# EAGLE board GEVCU-4 (EAGLE 6.1)
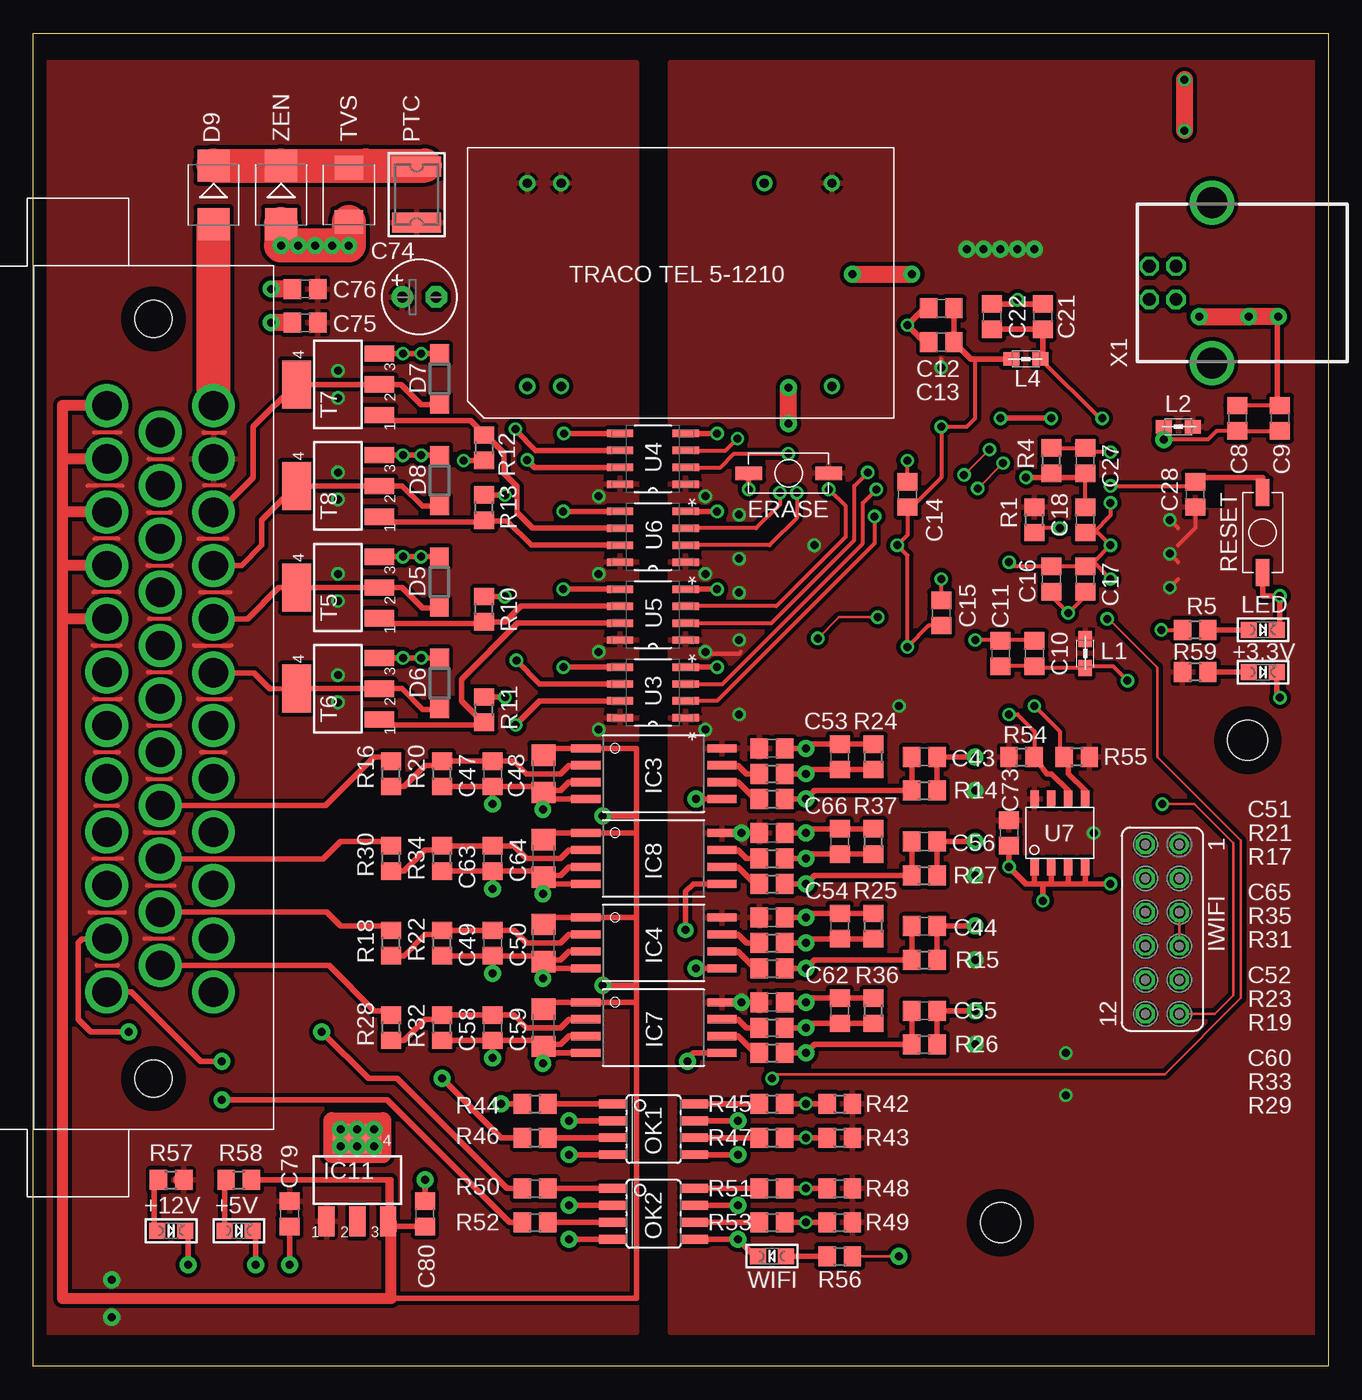
[diagram p2: board, top side]
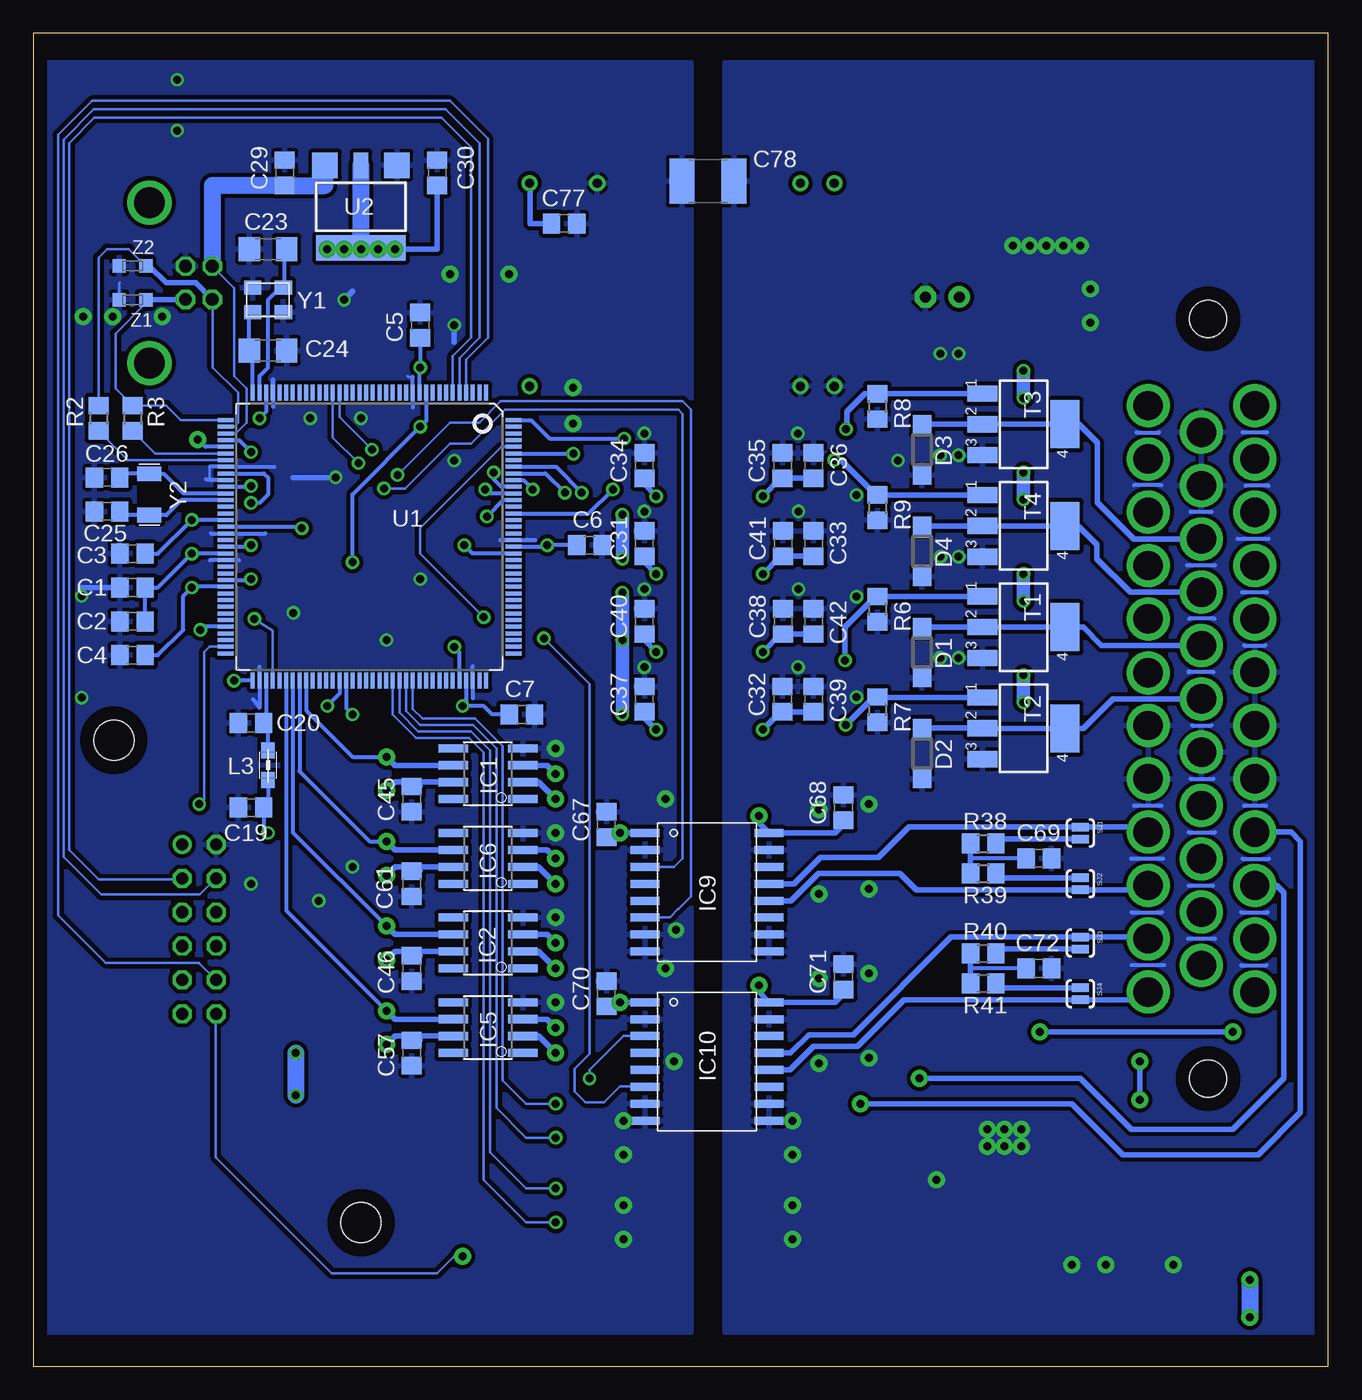
[diagram p3: board, bottom side, seen from below]

Size 97.16 x 100 mm. Coordinates in mm from the lower left corner, seen from the top.
Outline: 0,100 97.16,100 97.16,0 0,0 0,100
Copper layers (1*16): Top 0.035mm / dielectric 1.5mm / Bottom 0.035mm
Design rules: minimum track width 10mil, minimum drill 24mil, track to track 12mil, track to pad 12mil, pad to pad 12mil, via to via 12mil, smd to smd 12mil, copper to edge 40mil, drill to drill 8mil, minimum pad ring 10mil, minimum via ring 8mil, stop-mask expansion 0.1mm, vias tented up to drill 0.6mm, thermal gap 10mil
Net classes: 0 default: width 0.203 mm, drill 0.305 mm, clearance 0.203 mm; 1 USB: drill 0.406 mm, clearance 0.203 mm to class 0, clearance 0.406 mm; 2 gnd: width 0.305 mm, drill 0.406 mm, clearance 0.203 mm to class 0, clearance 0.203 mm; 3 usbvcc: width 0.61 mm, drill 0.508 mm, clearance 0.203 mm to class 0, clearance 0.254 mm
Holes 3 mm at 91.11,46.96 72.57,10.77

## Footprints (pad centres in the part's own frame; a part is rotated, then mirrored left to right if it is on the bottom)
CHIPLED_0805 = smd 1.2 x 1.2: A 0,-1.05; C 0,1.05
AMPSEAL35 = drill 2.2: 1 -20,0; 2 -16,0; 3 -12,0; 4 -8,0; 5 -4,0; 6 0.05,0; 7 4,0; 8 8,0; 9 12,0; 10 16,0; 11 20,0; 12 24,0; 13 -18,-4; 14 -14,-4; 15 -10,-4; 16 -6,-4; 17 -2,-4; 18 2,-4; 19 6,-4; 20 10,-4; 21 14,-4; 22 18,-4; 23 22,-4; 24 -20,-8; 25 -16,-8; 26 -12,-8; 27 -8,-8; 28 -4,-8; 29 0,-8; 30 4,-8; 31 8,-8; 32 12,-8; 33 16,-8; 34 20,-8; 35 24,-8 | hole 2.8: -26.5,-4.5; 30.5,-4.5
C0805 = smd 1.3 x 1.5: 1 -0.95,0; 2 0.95,0
C1206 = smd 1.6 x 1.8: 1 -1.4,0; 2 1.4,0
E2,5-6 = drill 0.813 pad 1.6: + -1.27,0 | drill 0.813 pad 1.6 octagon: - 1.27,0
C1812 = smd 1.9 x 3.4: 1 -1.95,0; 2 1.95,0
SOD123 = smd 1.4 x 1.4: A 1.9,0; C -1.9,0
SMB = smd 2.4 x 2.4: A 2.2,0; C -2.2,0
PUCHBUTTON = smd 2 x 1: P$1 3,0; P$2 -3,0
SO08 = smd 0.61 x 2.21: 1 -1.905,-2.616; 2 -0.635,-2.616; 3 0.635,-2.616; 4 1.905,-2.616; 5 1.905,2.616; 6 0.635,2.616; 7 -0.635,2.616; 8 -1.905,2.616
CK_CUSTOM_SO8-WIDE = smd 0.61 x 2.21: 1 -1.905,-5.069; 2 -0.635,-5.069; 3 0.635,-5.069; 4 1.905,-5.069; 5 1.905,5.136; 6 0.635,5.136; 7 -0.635,5.136; 8 -1.905,5.136
DUB-R-PDSO-G8 = smd 0.6 x 2.2: 1 -4.445,-4.65; 2 -3.175,-4.65; 3 -1.905,-4.65; 4 -0.635,-4.65; 5 0.635,-4.65; 6 1.905,-4.65; 7 3.175,-4.65; 8 4.445,-4.65; 9 -4.445,4.65; 10 -3.175,4.65; 11 -1.905,4.65; 12 -0.635,4.65; 13 0.635,4.65; 14 1.905,4.65; 15 3.175,4.65; 16 4.445,4.65
SOT223 = smd 1.219 x 2.235: 1 -2.311,-3.099; 2 0,-3.099; 3 2.311,-3.099 | smd 3.6 x 2.2: 4 0,3.099
FE06-2 = drill 0.914: 1 -6.35,1.27 | drill 0.914 octagon: 2 -6.35,-1.27; 3 -3.81,1.27; 4 -3.81,-1.27; 5 -1.27,1.27; 6 -1.27,-1.27; 7 1.27,1.27; 8 1.27,-1.27; 9 3.81,1.27; 10 3.81,-1.27; 11 6.35,1.27; 12 6.35,-1.27
0805 = smd 1.2 x 1: 1 -1.1,0; 2 1.1,0
SOIC08 = smd 0.66 x 2.032: 1 -1.905,-3.073; 2 -0.635,-3.073; 3 0.635,-3.073; 4 1.905,-3.073; 5 1.905,3.073; 6 0.635,3.073; 7 -0.635,3.073; 8 -1.905,3.073
PTC1812 = smd 1.5 x 3.7: P$1 -2.1,0; P$2 2.1,0
R0805 = smd 1.3 x 1.5: 1 -0.95,0; 2 0.95,0
SJ_2S-NO = smd 0.635 x 1.27: 1 -0.45,0; 2 0.45,0
SMBJ = smd 1.78 x 2.16: A 2.04,0; C -2.03,0
LQFP144 = smd 0.3 x 1.2: 1 -8.75,-10.8; 2 -8.25,-10.8; 3 -7.75,-10.8; 4 -7.25,-10.8; 5 -6.75,-10.8; 6 -6.25,-10.8; 7 -5.75,-10.8; 8 -5.25,-10.8; 9 -4.75,-10.8; 10 -4.25,-10.8; 11 -3.75,-10.8; 12 -3.25,-10.8; 13 -2.75,-10.8; 14 -2.25,-10.8; 15 -1.75,-10.8; 16 -1.25,-10.8; 17 -0.75,-10.8; 18 -0.25,-10.8; 19 0.25,-10.8; 20 0.75,-10.8; 21 1.25,-10.8; 22 1.75,-10.8; 23 2.25,-10.8; 24 2.75,-10.8; 25 3.25,-10.8; 26 3.75,-10.8; 27 4.25,-10.8; 28 4.75,-10.8; 29 5.25,-10.8; 30 5.75,-10.8; 31 6.25,-10.8; 32 6.75,-10.8; 33 7.25,-10.8; 34 7.75,-10.8; 35 8.25,-10.8; 36 8.75,-10.8; 73 8.75,10.8; 74 8.25,10.8; 75 7.75,10.8; 76 7.25,10.8; 77 6.75,10.8; 78 6.25,10.8; 79 5.75,10.8; 80 5.25,10.8; 81 4.75,10.8; 82 4.25,10.8; 83 3.75,10.8; 84 3.25,10.8; 85 2.75,10.8; 86 2.25,10.8; 87 1.75,10.8; 88 1.25,10.8; 89 0.75,10.8; 90 0.25,10.8; 91 -0.25,10.8; 92 -0.75,10.8; 93 -1.25,10.8; 94 -1.75,10.8; 95 -2.25,10.8; 96 -2.75,10.8; 97 -3.25,10.8; 98 -3.75,10.8; 99 -4.25,10.8; 100 -4.75,10.8; 101 -5.25,10.8; 102 -5.75,10.8; 103 -6.25,10.8; 104 -6.75,10.8; 105 -7.25,10.8; 106 -7.75,10.8; 107 -8.25,10.8; 108 -8.75,10.8 | smd 1.2 x 0.3: 37 10.8,-8.75; 38 10.8,-8.25; 39 10.8,-7.75; 40 10.8,-7.25; 41 10.8,-6.75; 42 10.8,-6.25; 43 10.8,-5.75; 44 10.8,-5.25; 45 10.8,-4.75; 46 10.8,-4.25; 47 10.8,-3.75; 48 10.8,-3.25; 49 10.8,-2.75; 50 10.8,-2.25; 51 10.8,-1.75; 52 10.8,-1.25; 53 10.8,-0.75; 54 10.8,-0.25; 55 10.8,0.25; 56 10.8,0.75; 57 10.8,1.25; 58 10.8,1.75; 59 10.8,2.25; 60 10.8,2.75; 61 10.8,3.25; 62 10.8,3.75; 63 10.8,4.25; 64 10.8,4.75; 65 10.8,5.25; 66 10.8,5.75; 67 10.8,6.25; 68 10.8,6.75; 69 10.8,7.25; 70 10.8,7.75; 71 10.8,8.25; 72 10.8,8.75; 109 -10.8,8.75; 110 -10.8,8.25; 111 -10.8,7.75; 112 -10.8,7.25; 113 -10.8,6.75; 114 -10.8,6.25; 115 -10.8,5.75; 116 -10.8,5.25; 117 -10.8,4.75; 118 -10.8,4.25; 119 -10.8,3.75; 120 -10.8,3.25; 121 -10.8,2.75; 122 -10.8,2.25; 123 -10.8,1.75; 124 -10.8,1.25; 125 -10.8,0.75; 126 -10.8,0.25; 127 -10.8,-0.25; 128 -10.8,-0.75; 129 -10.8,-1.25; 130 -10.8,-1.75; 131 -10.8,-2.25; 132 -10.8,-2.75; 133 -10.8,-3.25; 134 -10.8,-3.75; 135 -10.8,-4.25; 136 -10.8,-4.75; 137 -10.8,-5.25; 138 -10.8,-5.75; 139 -10.8,-6.25; 140 -10.8,-6.75; 141 -10.8,-7.25; 142 -10.8,-7.75; 143 -10.8,-8.25; 144 -10.8,-8.75
SOT223-W = smd 1.9 x 1.9: 1 -2.7,-3.1; 3 2.7,-3.1 | smd 1.1 x 1.9: 2 0,-3.1 | smd 6.7 x 1.9: 4 0,3.1
SOIC127P600X175-8N = smd 1.981 x 0.559: 1 -2.464,1.905; 2 -2.464,0.635; 3 -2.464,-0.635; 4 -2.464,-1.905; 5 2.464,-1.905; 6 2.464,-0.635; 7 2.464,0.635; 8 2.464,1.905
CK_CUSTOM_SOIC8 = smd 0.635 x 1.27: PIN1 -1.905,-2.54; PIN2 -0.635,-2.54; PIN3 0.635,-2.54; PIN4 1.905,-2.54; PIN5 1.905,2.54; PIN6 0.635,2.54; PIN7 -0.635,2.54; PIN8 -1.905,2.54
TRACO = drill 0.7: +VIN1 4.5,17.64; +VIN2 7.04,17.64; +VOUT 27.36,17.64; -VIN1 4.5,2.4; -VIN2 7.04,2.4; -VOUT 22.28,17.64; P$6 27.36,2.4
PN61729-S = drill 0.95 octagon: 1 1.25,4.71; 2 -1.25,4.71; 3 -1.25,2.71; 4 1.25,2.71 | drill 2.3 pad 2.9: S1 -6.02,0; S2 6.02,0
CRYSTAL-3.2-2.5 = smd 1.3 x 1.05: 1 -1.15,-0.925; 2 1.15,-0.925; 3 1.15,0.925; 4 -1.15,0.925
RESONATOR_EPSON_FC_145 = smd 1.1 x 1.8: P$1 -1.55,0; P$2 1.55,0
CT/CN0603 = smd 1 x 1: 1 -1,0; 2 1,0

## Placement (x,y rotation side)
+3.3V  [CHIPLED_0805]  92.25,52.07 270 top
+5V  [CHIPLED_0805]  15.42,10.16 270 top
+12V  [CHIPLED_0805]  10.34,10.16 270 top
AMPSEAL1  776163-1  [AMPSEAL35]  13.51,52.07 270 top
C1  10u  [C0805]  89.71,58.42 180 bottom
C2  0.1u  [C0805]  89.71,55.88 180 bottom
C3  0.1u  [C0805]  89.71,60.96 180 bottom
C4  0.1u  [C0805]  89.71,53.34 180 bottom
C5  0.1u  [C0805]  68.12,78.11 90 bottom
C6  0.1u  [C0805]  55.42,61.59 0 bottom
C7  0.1u  [C0805]  60.5,48.9 0 bottom
C8  0.1u  [C0805]  90.35,71.12 90 top
C9  10u  [C0805]  93.52,71.12 90 top
C10  0.1u  [C0805]  75.11,53.47 90 top
C11  10u  [C0805]  72.57,53.47 90 top
C12  10u  [C0805]  68.12,79.38 180 top
C13  0.1u  [C0805]  68.12,76.83 180 top
C14  0.1u  [C0805]  65.58,65.41 90 top
C15  0.1u  [C0805]  68.12,56.52 90 top
C16  0.1u  [C0805]  76.38,59.05 270 top
C17  0.1u  [C0805]  78.92,59.05 270 top
C18  0.1u  [C0805]  78.92,63.5 90 top
C19  0.1u  [C0805]  80.82,41.91 180 bottom
C20  0.1u  [C0805]  80.82,48.26 180 bottom
C21  0.1u  [C0805]  75.74,78.74 90 top
C22  10u  [C0805]  71.93,78.74 90 top
C23  22p  [C1206]  79.55,83.82 180 bottom
C24  22p  [C1206]  79.55,76.2 0 bottom
C25  22p  [C0805]  91.62,64.14 180 bottom
C26  22p  [C0805]  91.62,66.67 180 bottom
C27  22p  [C0805]  78.92,67.94 270 top
C28  0.01u  [C0805]  87.17,65.41 90 top
C29  10u  [C0805]  78.28,89.53 90 bottom
C30  10u  [C0805]  66.85,89.53 90 bottom
C31  0.1u  [C0805]  51.31,61.72 90 bottom
C32  0.1u  [C0805]  40.94,50.04 90 bottom
C33  10u  [C0805]  38.61,61.72 90 bottom
C34  0.1u  [C0805]  51.31,67.56 90 bottom
C35  0.1u  [C0805]  40.94,67.56 90 bottom
C36  10u  [C0805]  38.61,67.56 90 bottom
C37  0.1u  [C0805]  51.31,50.04 90 bottom
C38  0.1u  [C0805]  40.89,55.88 90 bottom
C39  10u  [C0805]  38.61,50.04 90 bottom
C40  0.1u  [C0805]  51.31,55.88 90 bottom
C41  0.1u  [C0805]  40.89,61.72 90 bottom
C42  10u  [C0805]  38.61,55.88 90 bottom
C43  100p  [C0805]  66.85,45.72 180 top
C44  100p  [C0805]  66.85,33.02 180 top
C45  0.1u  [C0805]  68.76,42.55 270 bottom
C46  0.1u  [C0805]  68.76,29.84 270 bottom
C47  0.1u  [C0805]  34.47,44.45 270 top
C48  0.1u  [C1206]  38.28,44.45 270 top
C49  0.1u  [C0805]  34.47,31.75 270 top
C50  0.1u  [C1206]  38.28,31.75 270 top
C51  0.1u  [C0805]  55.42,46.35 0 top
C52  0.1u  [C0805]  55.42,33.66 0 top
C53  100p  [C0805]  60.5,45.72 90 top
C54  100p  [C0805]  60.5,33.02 90 top
C55  100p  [C0805]  66.85,26.67 180 top
C56  100p  [C0805]  66.85,39.37 180 top
C57  0.1u  [C0805]  68.76,23.5 270 bottom
C58  0.1u  [C0805]  34.47,25.4 270 top
C59  0.1u  [C1206]  38.28,25.4 270 top
C60  0.1u  [C0805]  55.42,27.3 0 top
C61  0.1u  [C0805]  68.76,36.2 270 bottom
C62  100p  [C0805]  60.5,26.67 90 top
C63  0.1u  [C0805]  34.47,38.1 270 top
C64  0.1u  [C1206]  38.28,38.1 270 top
C65  0.1u  [C0805]  55.42,40.01 0 top
C66  100p  [C0805]  60.5,39.37 90 top
C67  0.1u  [C0805]  54.15,40.64 90 bottom
C68  0.1u  [C0805]  36.37,41.91 90 bottom
C69  47n  [C0805]  21.72,38.1 0 bottom
C70  0.1u  [C0805]  54.15,27.94 90 bottom
C71  0.1u  [C0805]  36.37,29.21 90 bottom
C72  47n  [C0805]  21.72,29.84 0 bottom
C73  0.1u  [C0805]  73.2,40.01 270 top
C74  100u  [E2,5-6]  28.96,80.21 0 top
C75  1u  [C0805]  20.4,78.28 180 top
C76  0.1u  [C0805]  20.4,80.82 180 top
C77  2u  [C0805]  57.33,85.72 0 bottom
C78  0.01u  [C1812]  46.53,88.9 180 bottom
C79  0.22u  [C0805]  19.23,11.43 270 top
C80  0.1u  [C0805]  29.39,11.43 90 top
D1  MBR0520LT  [SOD123]  30.48,53.54 270 bottom
D2  MBR0520LT  [SOD123]  30.48,45.97 270 bottom
D3  MBR0520LT  [SOD123]  30.48,68.76 270 bottom
D4  MBR0520LT  [SOD123]  30.48,61.14 270 bottom
D5  MBR0520LT  [SOD123]  30.45,58.83 90 top
D6  MBR0520LT  [SOD123]  30.48,51.23 90 top
D7  MBR0520LT  [SOD123]  30.48,74.07 90 top
D8  MBR0520LT  [SOD123]  30.48,66.45 90 top
D9  B360B-13-F  [SMB]  13.51,87.88 270 top
ERASE  PUCHBUTTON  [PUCHBUTTON]  56.67,66.99 180 top
IC1  INA132  [SO08]  63.04,44.45 90 bottom
IC2  INA132  [SO08]  63.04,31.75 90 bottom
IC3  CK_CUSTOM_ACPL-C87A-000E  [CK_CUSTOM_SO8-WIDE]  46.53,44.45 270 top
IC4  CK_CUSTOM_ACPL-C87A-000E  [CK_CUSTOM_SO8-WIDE]  46.53,31.75 270 top
IC5  INA132  [SO08]  63.04,25.4 90 bottom
IC6  INA132  [SO08]  63.04,38.1 90 bottom
IC7  CK_CUSTOM_ACPL-C87A-000E  [CK_CUSTOM_SO8-WIDE]  46.53,25.4 270 top
IC8  CK_CUSTOM_ACPL-C87A-000E  [CK_CUSTOM_SO8-WIDE]  46.53,38.1 270 top
IC9  ISO1050DW  [DUB-R-PDSO-G8]  46.61,35.56 270 bottom
IC10  ISO1050DW  [DUB-R-PDSO-G8]  46.61,22.86 270 bottom
IC11  LM340MP-05  [SOT223]  24.31,13.97 0 top
IWIFI  [FE06-2]  84.71,32.79 270 top
L1  MH2029-300Y  [0805]  78.92,53.47 270 top
L2  MH2029-300Y  [0805]  85.9,70.48 180 top
L3  MH2029-300Y  [0805]  79.55,45.09 90 bottom
L4  MH2029-300Y  [0805]  74.47,75.56 0 top
LED  [CHIPLED_0805]  92.25,55.24 270 top
OK1  ILD213  [SOIC08]  46.53,17.78 270 top
OK2  ILD213  [SOIC08]  46.53,11.43 270 top
PTC  [PTC1812]  28.75,87.88 90 top
R1  100k  [R0805]  75.11,63.5 90 top
R2  39R 1%  [R0805]  92.25,71.12 270 bottom
R3  39R 1%  [R0805]  89.71,71.12 270 bottom
R4  6k8 1%  [R0805]  76.38,67.94 90 top
R5  402R  [R0805]  87.17,55.24 180 top
R6  10k  [R0805]  33.83,56.79 270 bottom
R7  10k  [R0805]  33.83,49.25 270 bottom
R8  10k  [R0805]  33.83,72.01 270 bottom
R9  10k  [R0805]  33.83,64.41 270 bottom
R10  10k  [R0805]  33.83,56.79 90 top
R11  10k  [R0805]  33.83,49.25 90 top
R12  10k  [R0805]  33.83,68.91 270 top
R13  10k  [R0805]  33.83,64.41 90 top
R14  16k 1%  [R0805]  66.85,43.18 0 top
R15  16k 1%  [R0805]  66.85,30.48 0 top
R16  16k  [R0805]  26.85,44.45 90 top
R17  10k 1%  [R0805]  55.42,42.55 0 top
R18  16k  [R0805]  26.85,31.75 90 top
R19  10k 1%  [R0805]  55.42,29.84 0 top
R20  10k  [R0805]  30.66,44.45 90 top
R21  10k 1%  [R0805]  55.42,44.45 0 top
R22  10k  [R0805]  30.66,31.75 90 top
R23  10k 1%  [R0805]  55.42,31.75 0 top
R24  16k 1%  [R0805]  63.04,45.72 90 top
R25  16k 1%  [R0805]  63.04,33.02 90 top
R26  16k 1%  [R0805]  66.85,24.13 0 top
R27  16k 1%  [R0805]  66.85,36.83 0 top
R28  16k  [R0805]  26.85,25.4 90 top
R29  10k 1%  [R0805]  55.42,23.5 0 top
R30  16k  [R0805]  26.85,38.1 90 top
R31  10k 1%  [R0805]  55.42,36.2 0 top
R32  10k  [R0805]  30.66,25.4 90 top
R33  10k 1%  [R0805]  55.42,25.4 0 top
R34  10k  [R0805]  30.66,38.1 90 top
R35  10k 1%  [R0805]  55.42,38.1 0 top
R36  16k 1%  [R0805]  63.04,26.67 90 top
R37  16k 1%  [R0805]  63.04,39.37 90 top
R38  60R  [R0805]  25.88,39.22 0 bottom
R39  60R  [R0805]  25.88,36.98 0 bottom
R40  60R  [R0805]  25.88,30.96 0 bottom
R41  60R  [R0805]  25.88,28.73 0 bottom
R42  10k  [R0805]  60.5,19.68 0 top
R43  10k  [R0805]  60.5,17.14 0 top
R44  1k  [R0805]  37.64,19.68 0 top
R45  1k  [R0805]  55.42,19.68 0 top
R46  1k  [R0805]  37.64,17.14 0 top
R47  1k  [R0805]  55.42,17.14 0 top
R48  10k  [R0805]  60.5,13.34 0 top
R49  10k  [R0805]  60.5,10.79 0 top
R50  1k  [R0805]  37.64,13.34 0 top
R51  1k  [R0805]  55.42,13.34 0 top
R52  1k  [R0805]  37.64,10.79 0 top
R53  1k  [R0805]  55.42,10.79 0 top
R54  4.7k  [R0805]  74.14,45.72 0 top
R55  4.7k  [R0805]  78.28,45.72 180 top
R56  402R  [R0805]  60.5,8.26 0 top
R57  3k3  [R0805]  10.34,13.97 0 top
R58  1k  [R0805]  15.42,13.97 0 top
R59  402R  [R0805]  87.17,52.07 180 top
RESET  PUCHBUTTON  [PUCHBUTTON]  92.23,62.55 270 top
SJ1  SOLDERJUMPERNO  [SJ_2S-NO]  18.59,40.01 270 bottom
SJ2  SOLDERJUMPERNO  [SJ_2S-NO]  18.59,36.2 90 bottom
SJ3  SOLDERJUMPERNO  [SJ_2S-NO]  18.59,31.75 270 bottom
SJ4  SOLDERJUMPERNO  [SJ_2S-NO]  18.59,27.94 90 bottom
T1  [SOT223]  22.86,55.45 270 bottom
T2  [SOT223]  22.86,47.85 270 bottom
T3  [SOT223]  22.86,70.66 270 bottom
T4  [SOT223]  22.86,63.04 270 bottom
T5  [SOT223]  22.86,58.42 90 top
T6  [SOT223]  22.86,50.83 90 top
T7  [SOT223]  22.86,73.66 90 top
T8  [SOT223]  22.86,66.04 90 top
TVS  SMBJ15A-TR  [SMBJ]  23.67,87.88 270 top
U1  ATSAM3X8EA-AU  [LQFP144]  71.93,62.23 180 bottom
U2  [SOT223-W]  72.57,87 180 bottom
U3  ADUM3221BRZ  [SOIC127P600X175-8N]  46.48,50.55 180 top
U4  ADUM3221BRZ  [SOIC127P600X175-8N]  46.48,68.07 180 top
U5  ADUM3221BRZ  [SOIC127P600X175-8N]  46.48,56.39 180 top
U6  ADUM3221BRZ  [SOIC127P600X175-8N]  46.48,62.23 180 top
U7  CK_CUSTOM_M24M02-DRMN6TP  [CK_CUSTOM_SOIC8]  77.01,40.01 0 top
U8  TRACO  [TRACO]  32.56,71.12 0 top
WIFI  [CHIPLED_0805]  55.42,8.26 90 top
X1  PN61729-S  [PN61729-S]  88.44,81.28 90 top
Y1  12MHz KX-7 20pF  [CRYSTAL-3.2-2.5]  79.55,80.01 0 bottom
Y2  32.768Khz  [RESONATOR_EPSON_FC_145]  88.44,65.41 90 bottom
Z1  CG0603MLC-05E  [CT/CN0603]  89.71,80.01 180 bottom
Z2  CG0603MLC-05E  [CT/CN0603]  89.71,82.55 180 bottom
ZEN  1SMB5929BT3G  [SMB]  18.59,87.88 270 top

## Tracks (layer width: path | path; a pad name or v marks a point on that pad's centre or on a via)
+3V3  (via drill 0.6, 0.6 pad 1.27)
  Top 0.305: v68.12,74.93 68.12,75.56 | v85.27,58.42 85.9,59.05 | v85.27,60.96 85.9,60.33 | v85.27,63.5 85.9,62.87 | C28.1 87.17,62.87 85.9,61.59 | 53.09,64.01 v52.96,63.88 | 50.42,53.47 52.96,53.47 53.09,53.59
  Top 0.406: v50.42,65.28 50.42,65.15 | v50.42,53.59 50.42,53.47 | v50.42,47.75 50.42,47.5
  Bottom 0.305: U1.11 68.18,74.87 v68.12,74.93 C5.1 | U1.125 58.71,61.48 v58.6,61.59 C6.1 | U1.105 64.68,49.8 v64.95,49.53 63.36,49.53 62.73,48.9 C7.1 61.14,48.9 | U1.62 85.21,58.48 v85.27,58.42 85.9,57.78 85.9,55.24 87.81,53.34 C4.1 88.44,53.34 | U1.57 85.25,60.98 v85.27,60.96 87.81,58.42 C1.1 C2.1 | U1.52 85.25,63.48 v85.27,63.5 87.81,60.96 C3.1 | L3.1 79.55,42.23 C19.1 79.87,40.33 v79.55,40.01
  Bottom 0.406: 54.15,26.67 C70.1 54.15,27.3 v53.14,27.3 IC10.1 | 53.83,39.37 C67.1 54.15,40.01 v53.14,40.01 IC9.1 | U8.+VOUT 59.87,88.76 59.87,85.72 C77.1 57.96,85.72 | IC1.7 68.12,43.81 | v70.66,43.18 70.03,43.81 68.12,43.81 | IC6.7 68.12,37.47 | v70.66,36.83 70.03,37.47 68.12,37.47 | IC2.7 68.12,31.11 | v70.66,30.48 70.03,31.11 68.12,31.11 | IC5.7 68.12,24.77 | v70.66,24.13 70.03,24.77 68.12,24.77 | C45.1 68.12,43.49 68.12,43.81 | C61.1 68.12,37.15 68.12,37.47 | C46.1 68.12,30.8 68.12,31.11 | C57.1 68.12,24.45 68.12,24.77 | C30.1 66.85,83.82 v71.3,83.82 | 51.31,66.62 C34.1 51.31,66.17 v50.42,65.28 | C31.1 51.31,60.33 v50.42,59.44 | C40.1 51.31,54.48 v50.42,53.59 | C37.1 51.31,48.64 v50.42,47.75
  Bottom 1.016: v52.96,63.88 v52.96,60.58 | v52.96,58.04 v52.96,54.48 v52.96,48.9
  Bottom 1.27: v72.57,83.82 U2.2 | v77.47,23.5 v77.47,20.32
  other vias: 75.11,83.82 73.84,83.82 70.03,83.82
  pour Top: 47.8,97.79 97.16,97.79 97.16,2.54 47.8,2.54
+5V  (via drill 0.6 pad 1.27)
  Top 0.406: C80.1 26.62,10.48 IC11.3 26.62,13.97 | R58.2 26.62,13.97 | 26.62,13.97 26.85,13.97 26.85,10.16 | 26.85,5.08 45.26,5.08 45.26,27.3 | 45.26,27.3 45.26,28.57 | 45.26,28.57 45.26,33.66 | 45.26,33.66 45.26,40.01 | 45.26,41.27 45.26,46.35 IC3.1 38.78,46.35 C48.1 | 45.26,40.01 IC8.1 38.28,40.01 C64.1 | 45.26,33.66 IC4.1 38.78,33.66 C50.1 | 45.26,27.3 IC7.1 38.28,27.3 C59.1 38.28,26.67 | v42.72,41.27 45.26,41.27 | 45.26,41.27 45.26,40.01 | v42.72,28.57 45.26,28.57
  Top 0.813: AMPSEAL1.24 2.18,72.07 2.18,68.07 | 2.18,68.07 2.18,64.07 | 2.18,64.07 2.18,60.07 | 2.18,60.07 2.18,56.07 | AMPSEAL1.25 2.18,68.07 | AMPSEAL1.26 2.18,64.07 | AMPSEAL1.27 2.18,60.07 | AMPSEAL1.28 2.18,56.07 | 2.18,56.07 2.18,5.08 26.85,5.08 26.85,10.16 26.85,10.79
  Bottom 0.406: C71.1 36.37,27.94 37.01,27.3 41.91,27.3 41.96,27.36 IC10.9 42.72,28.07 v42.72,28.57 | C68.1 36.37,40.64 37.01,40.01 IC9.9 | IC9.9 42.72,40.77 v42.72,41.27 | IC9.9
+12V  (via drill 0.6, 0.6 pad 1.27)
  Top 0.305: 6.66,38.08 4.5,38.08 | 12.06,54.07 14.86,54.07 | 12.34,50.06 14.81,50.06 | 4.22,34.06 6.88,34.06 | 4.65,42.06 6.35,42.06 | 12.75,70.05 14.38,70.05 | 8.64,68.07 10.44,68.07 | 12.8,66.09 14.35,66.09 | 8.61,64.06 10.34,64.06 | 12.39,62.08 14.58,62.08 | 12.5,58.06 14.78,58.06 | 12.57,46.08 14.43,46.08 | 4.45,54.08 6.53,54.08 | 4.55,50.06 6.58,50.06 | 4.62,46.08 6.43,46.08 | 8.56,60.07 10.41,60.07 | 8.69,56.08 10.21,56.08 | 8.59,52.07 10.31,52.07 | 8.61,48.08 10.29,48.08 | 8.56,44.07 10.31,44.07 | 4.55,70.08 6.53,70.08 | 4.72,30.07 6.35,30.07 | 8.33,32.08 10.49,32.08 | 8.51,36.07 10.59,36.07 | 8.38,40.06 10.57,40.06 | 6.71,66.06 4.06,66.06 | 6.45,58.06 4.5,58.06 | 6.4,62.08 4.6,62.08
  Top 0.406: v42.42,65.28 42.42,65.15 | v42.42,59.44 42.42,59.31 | v42.42,53.59 42.42,53.47 | v42.42,47.75 42.42,47.62
  Top 1.016: R57.2 10.97,13.97
  Bottom 0.406: 38.61,66.34 C36.1 C35.1 41.08,66.61 v42.42,65.28 | v42.42,59.44 41.08,60.77 C41.1 C33.1 | v42.42,53.59 41.08,54.93 C38.1 C42.1 | v42.42,47.75 41.08,49.09 C32.1 C39.1
  Bottom 1.016: v22.86,74.68 22.86,72.67 22.84,72.64 | v22.86,51.84 v22.86,49.81 | v22.86,67.06 v22.86,65.02 | v22.86,59.44 v22.86,57.4
  Bottom 1.27: v5.89,6.48 v5.89,3.68
  other vias: 22.86,72.64
  pour Top: 0,97.79 45.26,97.79 45.26,2.54 0,2.54
A0  (via drill 0.6 pad 1.27)
  Top 0.406: R26.2 C55.1 v70.66,26.67
  Bottom 0.305: U1.78 78.18,34.19 v70.66,26.67
  Bottom 0.406: IC5.6 70.03,26.04 v70.66,26.67
A1  (via drill 0.6 pad 1.27)
  Top 0.406: R15.2 C44.1 v70.66,33.02
  Bottom 0.305: U1.79 77.68,40.04 v70.66,33.02
  Bottom 0.406: IC2.6 70.03,32.38 v70.66,33.02
A2  (via drill 0.6 pad 1.27)
  Top 0.406: R27.2 C56.1 v70.66,39.37
  Bottom 0.305: U1.80 77.18,44.62 71.93,39.37 v70.66,39.37
  Bottom 0.406: IC6.6 70.03,38.73 v70.66,39.37
A3  (via drill 0.6 pad 1.27)
  Top 0.406: R14.2 C43.1 v70.66,45.72
  Bottom 0.305: U1.81 76.68,49.2 73.2,45.72 v70.66,45.72
  Bottom 0.406: IC1.6 70.03,45.09 v70.66,45.72
AIN0
  Top 0.406: AMPSEAL1.20 21.93,42.07 25.58,45.72 26.53,45.72 R16.2
AIN1
  Top 0.406: AMPSEAL1.21 21.74,38.07 23.04,39.37 26.53,39.37 R30.2
AIN2
  Top 0.406: AMPSEAL1.22 21.99,34.07 23.04,33.02 26.85,33.02 R18.2 26.85,32.38
AIN3
  Top 0.406: AMPSEAL1.23 22.18,30.07 25.58,26.67 26.85,26.67 R28.2 26.85,26.04
AVREF
  Bottom 0.305: U1.75 79.68,47.76 | 79.68,47.76 79.55,47.62 L3.2 | C20.1 79.87,47.95 79.68,47.76
CANH0
  Bottom 0.406: AMPSEAL1.9 13.9,40.45 SJ1.1 31.48,40.45 33.76,38.18 38.1,38.18 40.08,36.2 IC9.12
CANH1
  Bottom 0.406: AMPSEAL1.11 13.51,31.75 13.96,32.2 SJ3.1 28.3,32.2 35.64,24.87 38.96,24.87 40.34,23.5 IC10.12
CANL0
  Bottom 0.406: AMPSEAL1.10 13.84,35.74 SJ2.1 30.91,35.74 32.15,36.98 38.25,36.98 40.31,34.92 IC9.13
CANL1
  Bottom 0.406: AMPSEAL1.12 14.09,27.49 SJ4.1 31.82,27.49 35.31,24 38.61,24 40.39,22.23 IC10.13
CANRX0  (via drill 0.6)
  Top 0.203: v72.76,67.75 v70.85,65.85
  Bottom 0.203: U1.24 74.68,69.68 v72.76,67.75 | v70.85,65.85 69.27,65.85 65.9,69.22 64.31,69.22 61.77,71.75 48.76,71.75 48.44,71.44 48.44,38.1 49.07,37.47 IC9.3 51.31,37.47
CANRX1  (via drill 0.6)
  Top 0.203: v80.57,56.07 80.64,56.11 80.7,56.07 84.34,52.43 84.34,45.7 90.6,39.43 90.6,27.62 84.89,21.91 55.74,21.91 v55.42,21.59
  Bottom 0.203: U1.76 79.18,55.19 v80.57,56.07 | v55.42,21.59 55.42,22.23 52.88,24.77 IC10.3
CANTX0  (via drill 0.6)
  Top 0.203: v71.74,68.77 v69.84,66.86
  Bottom 0.203: U1.23 74.18,71.21 v71.74,68.77 | v69.84,66.86 65.9,70.8 63.68,70.8 62.09,72.39 48.44,72.39 47.8,71.75 47.8,35.24 48.76,34.29 48.77,34.29 49.4,33.66 IC9.6
CANTX1  (via drill 0.6)
  Top 0.203: v63.36,56.2 60.44,56.2 v58.85,54.61
  Bottom 0.203: U1.140 62.01,68.98 68.12,62.87 68.12,60.96 v63.36,56.2 | v58.85,54.61 55.42,51.18 55.42,23.43 56.57,22.29 56.57,20.64 55.74,19.81 54.34,19.81 53.15,21.01 51.26,21.01 51.26,21 IC10.6
D2  (via drill 0.6)
  Top 0.305: U4.3 51.94,68.71 v52.83,69.6
  Bottom 0.305: U1.144 59.8,70.98 58.42,69.6 v52.83,69.6
D3  (via drill 0.6)
  Top 0.305: U4.2 51.56,67.44 52.58,68.45 v56.64,68.45
  Bottom 0.305: 56.77,68.45 v56.64,68.45 56.67,68.48 U1.139
D4  (via drill 0.6)
  Top 0.305: v56.01,65.53 56.01,64.64 54.23,62.87 U6.3
  Bottom 0.305: U1.137 57.95,67.48 v56.01,65.53
D5  (via drill 0.6)
  Top 0.305: v57.28,65.53 57.28,63.63 55.24,61.59 U6.2
  Bottom 0.305: U1.136 58.73,66.98 v57.28,65.53
D6  (via drill 0.6)
  Top 0.305: U5.3 55.75,57.02 60.96,62.23 60.96,64.52 v59.69,65.79
  Bottom 0.305: U1.135 60.38,66.48 v59.69,65.79
D7  (via drill 0.6)
  Top 0.305: U5.2 55.37,55.75 61.59,61.98 61.59,66.04 v62.61,67.06
  Bottom 0.305: U1.134 62.04,65.98 62.61,66.55 v62.61,67.06
D8  (via drill 0.6)
  Top 0.305: U3.3 51.69,51.18 62.23,61.72 62.23,64.77 v63.25,65.79
  Bottom 0.305: U1.133 62.94,65.48 v63.25,65.79
D9  (via drill 0.6)
  Top 0.305: v63.12,63.75 63.12,61.72 51.31,49.91 U3.2 48.9,49.91
  Bottom 0.305: U1.132 61.89,64.98 v63.12,63.75
D13  (via drill 0.6)
  Top 0.305: v84.63,55.24 R5.2
  Bottom 0.305: U1.68 84.4,55.48 v84.63,55.24
D18
  Bottom 0.203: U1.4 64.68,75.51 63.04,77.15 63.04,92.08 65.9,94.93 92.73,94.93 95.29,92.39 95.29,33.82 91.73,30.26 84.7,30.26 84.7,30.23 IWIFI.10
D42  (via drill 0.6)
  Top 0.203: v84.71,42.16 87.12,42.16 90.04,39.24 90.04,27.81 88.65,26.42 85.98,26.42 IWIFI.11
  Bottom 0.203: U1.71 83.94,53.98 84.33,53.59 84.33,42.55 v84.71,42.16
D48  (via drill 0.6)
  Top 0.406: R45.2 v57.96,19.68 R42.1
  Bottom 0.203: U1.97 68.68,49.3 67.96,48.58 63.99,48.58 61.93,46.51 61.93,21.43 60.19,19.68 v57.96,19.68
D49  (via drill 0.6)
  Top 0.406: R47.2 v57.96,17.14 R43.1
  Bottom 0.203: U1.96 69.18,49.16 68.12,48.1 64.15,48.1 62.41,46.35 62.41,19.37 60.19,17.14 v57.96,17.14
D50  (via drill 0.6)
  Top 0.406: R51.2 v57.96,13.34 R48.1
  Bottom 0.203: U1.95 69.68,49.03 68.28,47.62 64.31,47.62 62.88,46.2 62.88,16.03 60.19,13.34 v57.96,13.34
D51  (via drill 0.6)
  Top 0.406: R53.2 v57.96,10.79 R49.1
  Bottom 0.203: U1.94 70.18,48.89 68.44,47.15 64.47,47.15 63.36,46.04 63.36,13.97 60.19,10.79 v57.96,10.79
D+
  Bottom 0.203: Z1.1 88.71,79.74 90.98,77.47 90.98,73.34 R3.1 87.17,72.07 86.08,70.98 U1.37
  Bottom 0.406: Z1.1 85.75,80.01 X1.3
D-
  Bottom 0.203: R2.1 92.25,83.19 91.62,83.82 89.98,83.82 Z2.1 | U1.38 82.1,70.48 81.78,70.8 81.78,73.03 83.68,74.93 83.68,79.98 X1.2
  Bottom 0.406: Z2.1 88.44,82.55 87.17,81.28 84.98,81.28 X1.2
DIN0  (via drill 0.6 pad 1.27)
  Top 0.406: v35.1,19.68 R44.1 37.01,19.68
  Bottom 0.406: AMPSEAL1.32 2.78,40.07 2.08,39.37 2.08,19.05 5.26,15.88 15.42,15.88 19.23,19.68 v35.1,19.68
DIN1  (via drill 0.6 pad 1.27)
  Top 0.406: v30.66,21.59 35.1,17.14 R46.1
  Bottom 0.406: AMPSEAL1.33 3.86,36.07 3.35,35.56 3.35,21.59 7.16,17.78 14.78,17.78 18.59,21.59 v30.66,21.59
DIN2  (via drill 0.6 pad 1.27)
  Top 0.406: AMPSEAL1.34 3.67,32.07 3.35,31.75 3.35,26.04 4.3,25.08 v7.16,25.08 | 37.01,13.34 R50.1 35.56,13.34 27.3,21.59 25.15,21.59 21.72,25.02 21.59,25.02 v21.64,25.07 v21.64,25.08
  Bottom 0.406: v7.16,25.08 v21.64,25.08
DIN3  (via drill 0.6 pad 1.27)
  Top 0.406: AMPSEAL1.35 7.35,28.07 12.56,22.86 v14.15,22.86 | v14.15,19.99 26.54,19.99 35.74,10.79 R52.1
  Bottom 0.406: v14.15,22.86 v14.15,19.99
DOUT0
  Top 0.406: AMPSEAL1.3 13.9,64.07 16.51,66.67 16.51,70.48 19.68,73.66 T7.4 T7.2 27.61,73.66 29.11,72.16 D7.C
DOUT1
  Top 0.406: AMPSEAL1.4 15.62,60.07 17.14,61.59 17.14,63.5 19.68,66.04 T8.4 T8.2 27.69,66.04 29.21,64.52 30.48,64.52 D8.C
DOUT2
  Top 0.406: AMPSEAL1.5 16.07,56.07 18.41,58.42 T5.4 T5.2 27.69,58.42 29.21,56.9 30.42,56.9 D5.C
DOUT3
  Top 0.406: AMPSEAL1.6 16.56,52.02 17.78,50.8 T6.4 T6.2 27.66,50.83 29.21,49.28 30.35,49.28 30.48,49.4 D6.C
DOUT4
  Bottom 0.406: AMPSEAL1.15 14.6,62.07 17.32,64.8 17.32,69.29 18.72,70.69 19.74,70.69 T3.4 T3.2 D3.C
DOUT5
  Bottom 0.406: AMPSEAL1.16 14.87,58.07 17.35,60.55 17.35,61.65 18.69,62.99 19.71,62.99 T4.4 T4.2 D4.C
DOUT6
  Bottom 0.406: AMPSEAL1.17 17.01,54.07 18.39,55.45 T1.4 T1.2 30.53,55.45 30.58,55.5 30.54,55.5 D1.C
DOUT7
  Bottom 0.406: AMPSEAL1.18 16.17,50.07 18.39,47.85 T2.4 25.35,47.85 | 25.35,47.85 T2.2 | D2.C 25.37,47.87 25.35,47.85
ERASE_S  (via drill 0.6)
  Top 0.406: v53.68,65.79 53.67,66.36 ERASE.P$1
  Bottom 0.305: U1.130 55.48,63.98 v53.68,65.79
GND  (via drill 0.6, 0.6 pad 1.27)
  Top 0.406: R32.1 C58.2 | R22.1 C49.2 | R34.1 C63.2 | R20.1 C47.2 | C47.2 37.96,43.5 38.28,43.18 | C48.2 38.28,43.18 | C47.2 v34.47,42.16 | C58.2 32.56,24.45 | C49.2 v34.47,29.46 | C58.2 v34.47,23.11 | C49.2 37.83,30.8 C50.2 38.28,29.84 | C63.2 v34.47,35.81 | C47.2 36.37,43.5 | C47.2 34.47,43.18 | +12V.C 11.61,10.16 v11.61,7.62 | +5V.C 16.69,10.16 v16.69,7.62 | C79.2 v19.23,7.62 | C80.2 v29.39,13.97 | OK2.4 v40.18,9.53 | OK2.2 v40.18,12.06 | OK1.4 v40.18,15.88 | OK1.2 v40.18,18.41 | IC11.4 v24.31,16.51 | C48.2 38.78,42.55 IC3.4 38.28,42.55 C48.2 | 38.28,43.18 39.55,43.18 40.18,43.81 IC3.3 | C63.2 37.83,37.15 C64.2 | IC8.4 38.78,36.2 C64.2 | IC8.3 40.18,37.47 39.55,36.83 38.41,36.83 C64.2 | IC4.4 38.28,29.84 | IC4.3 40.18,31.11 39.55,30.48 38.91,30.48 38.28,29.84 | C58.2 34.78,24.45 34.47,24.77 | C58.2 37.83,24.45 C59.2 | IC7.4 38.15,23.5 C59.2 | IC7.3 40.18,24.77 39.55,24.13 38.41,24.13 C59.2 | v23.04,16.51 22.72,16.51 22.72,16.19 23.04,16.19 v23.04,16.51 | v23.04,16.51 22.4,16.51 | v38.23,41.78 38.23,43.18 | v38.23,35.43 38.23,36.83 | v38.23,29.08 38.23,30.23 | v38.23,22.73 38.23,24 | U4.5 v39.8,69.98 | U6.5 v39.75,64.14 | U5.5 v39.75,58.29 | U3.5 v39.78,52.45 | T7.3 v27.74,75.97 v29.11,75.97 D7.A | T8.3 v27.74,68.35 v29.11,68.35 30.5,68.35 30.53,68.33 30.5,68.33 D8.A | T5.3 v27.74,60.73 v29.08,60.73 D5.A | T6.3 v27.74,53.14 v29.11,53.14 D6.A | R12.2 32.3,67.96 v32.28,67.94 | R13.2 35.37,65.36 v35.38,65.35 | R10.2 35.37,57.74 v35.38,57.73 | R11.2 35.37,50.2 v35.38,50.19
  Top 1.27: C76.2 v17.86,80.82 | C75.2 v17.86,78.28 | 22.4,18.41 26.21,18.41 26.21,15.88 22.4,15.88 22.4,16.51 22.4,18.41
  Top 2.54: ZEN.A v18.59,84.07 v19.86,84.07 v21.13,84.07 v22.4,84.07 v23.67,84.07 TVS.A
  Bottom 0.305: 12.32,30.07 14.76,30.07 | 10.52,32.08 8.48,32.08 | 14.76,34.06 12.47,34.06 | 12.39,38.08 14.81,38.08 | 6.55,30.07 4.65,30.07 | 6.55,34.06 4.55,34.06 | 10.46,36.07 8.64,36.07 | 6.43,38.08 4.45,38.08 | 10.46,40.06 8.51,40.06 | 14.58,42.06 12.52,42.06 | 6.3,42.06 4.67,42.06 | 10.34,44.07 8.61,44.07 | 10.24,48.08 8.76,48.08 | 8.61,52.07 10.46,52.07 10.46,52.15 | 8.53,56.08 10.44,56.08 | 6.33,54.08 4.7,54.08 | 6.45,58.06 4.6,58.06 | 8.51,60.07 10.59,60.07 | 6.81,62.08 4.47,62.08 | 8.74,64.08 10.34,64.08 | 12.52,66.09 14.58,66.09 | 4.47,66.06 6.22,66.06 | 6.43,70.08 4.6,70.08 | 14.38,70.05 12.68,70.05
  Bottom 0.406: v39.8,69.98 40.11,69.98 40.11,69.93 | v39.75,64.14 39.88,64.14 39.88,64.11 | v39.75,58.29 39.88,58.29 | v39.78,52.45 39.93,52.45 39.93,52.48 | v35.38,65.35 35.23,65.33 | v35.38,50.19 35.41,50.19
  other vias: 23.04,17.78 24.31,17.78 25.58,17.78 25.58,16.51
  pour Bottom: 0,97.79 45.26,97.79 45.26,2.54 0,2.54
IGND  (via drill 0.6, 0.6 pad 1.19, 0.6 pad 1.27)
  Top 0.305: C16.2 76.38,57.78 v77.65,56.52 78.92,57.78 C17.2 | C18.2 C27.2 | C14.2 v65.58,67.94 | C15.2 v68.12,59.05 | C10.2 75.11,54.48 72.57,54.48 | C11.2 72.57,54.48 | 72.57,54.48 v70.66,54.48 | C9.2 C8.2 89.71,72.07
  Top 0.406: C51.2 v57.96,46.35 58.28,46.67 C53.2 R24.2 | IC3.5 v49.71,42.55 | IC8.5 49.53,36.2 48.95,35.61 v48.95,32.72 | C65.2 v57.96,40.01 58.28,40.32 C66.2 60.5,40.01 60.82,40.32 R37.2 | IC4.5 v49.71,29.84 | IC7.5 49.53,23.5 49.07,23.04 v49.07,22.86 | C52.2 v57.96,33.66 58.28,33.97 C54.2 60.5,33.66 60.82,33.97 R25.2 | OK1.7 v52.88,18.41 | OK1.5 v52.88,15.88 | OK2.7 v52.88,12.06 | OK2.5 v52.88,9.53 54.15,8.26 WIFI.C | C60.2 v57.96,27.3 58.28,27.62 C62.2 R36.2 | LED.C 93.52,55.24 v93.52,57.78 92.23,57.78 RESET.P$1 | +3.3V.C 93.3,50.58 v93.52,50.16 | C21.2 74.16,79.69 v73.84,80.01 73.52,79.69 C22.2 | C12.2 66.85,79.38 v65.58,78.11 66.85,76.83 C13.2 | R4.1 76.38,66.67 v74.47,66.67 78.92,66.67 C27.2 | C73.2 v73.2,37.47 74.47,36.2 75.11,36.2 | 75.11,36.2 75.74,36.2 | 76.38,36.2 77.65,36.2 | 77.65,36.2 78.92,36.2 | 78.92,36.2 U7.PIN4 | U7.PIN3 77.65,36.2 | U7.PIN2 76.38,36.2 | U7.PIN1 75.11,36.2 | v80.82,36.2 78.92,36.2 | 75.74,36.2 v75.74,34.92 | 76.38,36.2 75.74,36.2 | v72.57,71.12 v76.38,71.12 | C9.2 93.34,72.07 93.34,78.74 | U4.4 v51.31,69.98 | U6.4 v51.31,64.14 | U5.4 v51.31,58.29 | U3.4 v51.31,52.45
  Top 1.27: v61.45,81.92 v65.9,81.92 | v93.41,78.74 93.34,78.74 v91.2,78.74 v87.49,78.74 | v86.36,96.52 v86.36,92.71 | v56.67,70.71 v56.67,73.43
  Bottom 0.203: 68.68,74.22 69,74.22 69.08,74.3 | 83.92,67.48 83.92,66.61 84.01,66.52 | Z1.2 90.71,81.23 90.67,81.28
  Bottom 0.305: U1.12 | U1.12 68.68,74.22 | U1.12 68.68,71.93 | 83.92,67.46 83.92,67.48 U1.44 79.07,67.48 79.07,67.46 | 82.93,66.48 84.01,66.52 84.2,66.52 | U1.46 82.93,66.48 | 82.93,66.48 83.8,66.48 83.8,66.52 | 83.82,62.48 82.8,62.48 | 82.8,62.48 79.73,62.48 | U1.58 81.71,60.48 83.92,60.48 | U1.54 82.8,62.48 | U1.74 | U1.74 80.19,52.48 | U1.74 80.19,49.53 | 80.19,49.53 80.19,49.4 80.7,50.04 80.19,49.53 | U1.106 | U1.106 64.19,52.5 | U1.106 64.19,50.12 | U1.126 62.13,61.98 59.49,61.98 60.12,62 | U1.33 79.18,74.03 79.17,74.04 79.17,72.01 79.15,71.98
  Bottom 0.406: v93.52,57.78 93.84,57.78 | v93.52,50.16 93.52,50.48 | v73.84,80.01 73.2,80.64 | v65.58,78.11 65.58,76.83 | v74.47,66.67 77.65,66.67 | C1.2 93.5,58.42 93.5,57.78 | v51.31,69.98 51.1,69.98 | v51.31,64.14 51.23,64.14 51.23,64.11 | v51.31,58.29 51.16,58.29 51.16,58.32 | v51.31,52.45 51.21,52.45 51.21,52.48
  Bottom 1.27: C77.2
  pour Bottom: 47.8,97.79 97.16,97.79 97.16,2.54 47.8,2.54
MASTER-RESET  (via drill 0.6)
  Top 0.305: v80.82,66.04 86.54,66.04 87.17,66.67 C28.2
  Top 0.406: RESET.P$2 92.23,66.67 87.17,66.67
  Bottom 0.305: U1.47 80.88,65.98 v80.82,66.04
MDRIVE0
  Top 0.406: T7.1 26.42,71.35 26.82,70.94 32.79,70.94 33.88,69.85 33.84,69.85 R12.1 33.87,69.9 33.93,69.9 35.33,68.5 35.33,66.95 36.3,65.99 36.3,64.03 37.47,62.87 U6.6
MDRIVE1
  Top 0.305: 33.87,63.42 R13.1
  Top 0.406: T8.1 26.29,63.73 26.7,63.32 33.69,63.32 R13.1 | U6.7 37.36,61.59 35.53,63.42 33.87,63.42
MDRIVE2
  Top 0.406: T5.1 26.34,56.11 26.75,55.7 33.69,55.7 R10.1 33.85,55.83 35.38,55.83 36.58,57.02 U5.6
MDRIVE3
  Top 0.406: T6.1 26.36,48.51 26.77,48.11 33.64,48.11 R11.1 33.86,48.27 33.86,48.18 32.13,49.91 32.13,51.54 36.35,55.75 U5.7
MDRIVE4  (via drill 0.6)
  Top 0.406: v36.17,70.31 36.17,70.23 37.69,68.71 U4.6
  Bottom 0.406: T3.1 33.86,72.97 33.87,72.96 | R8.1 33.87,72.96 | 33.87,72.96 33.88,72.95 | 33.87,72.96 34.76,72.96 36.09,71.63 36.09,70.38 v36.17,70.31
MDRIVE5  (via drill 0.6)
  Top 0.406: v37.06,68 37.62,67.44 U4.7
  Bottom 0.406: R9.1 33.83,65.3 | T4.1 33.78,65.35 33.83,65.3 | v37.06,68 36.58,68 33.86,65.28 33.83,65.3
MDRIVE6  (via drill 0.6)
  Top 0.406: U3.6 44.04,51.21 44.07,51.21 44.09,51.23 44.09,51.1 44.07,51.1 44.02,51.16 U3.6 | U3.6 38,51.18 36.25,52.93 v36.25,52.96
  Bottom 0.406: T1.1 33.82,57.76 R6.1 | R6.1 33.83,57.76 | R6.1 33.98,57.74 36.25,55.47 v36.25,52.96
MDRIVE7  (via drill 0.6)
  Top 0.406: v36.2,48.11 38,49.91 43.99,49.91 44.04,49.86 44.04,49.89 U3.7
  Bottom 0.406: T2.1 33.8,50.16 R7.1 34.1,50.2 v36.2,48.11
N$1
  Top 0.406: R16.1 27.8,43.5 29.39,45.09 30.34,45.09 R20.2 C47.1 36.06,45.4 37.01,44.45 39.55,44.45 40.18,45.09 IC3.2
N$2
  Top 0.406: R59.1 +3.3V.A
N$3
  Top 0.406: TVS.C 24.94,90.08 | 29.39,90.42 28.75,90.42 PTC.P$2 28.75,90.08 29.39,90.08
  Top 2.54: D9.C ZEN.C 24.94,90.08 29.39,90.08
N$4
  Top 0.406: R58.1 14.37,13.97 +5V.A
N$6
  Top 0.406: R5.1 LED.A
N$8
  Top 0.406: IC8.7 52.88,38.73 53.52,38.1 R35.1
N$9
  Top 0.406: IC8.6 52.88,37.47 54.15,36.2 R31.1
N$12  (via drill 0.6 pad 1.27)
  Top 0.406: R31.2 v57.96,36.2 58.6,36.83 R27.1 C56.2
  Bottom 0.406: v57.96,36.2 59.23,37.47 IC6.2
N$13
  Top 0.406: IC3.7 52.88,45.09 53.52,44.45 R21.1
N$14
  Top 0.406: IC3.6 52.88,43.81 54.15,42.55 R17.1
N$15  (via drill 0.6 pad 1.27)
  Top 0.406: R17.2 v57.96,42.55 58.6,43.18 R14.1 C43.2
  Bottom 0.406: v57.96,42.55 59.23,43.81 IC1.2
N$16  (via drill 0.6 pad 1.27)
  Top 0.406: R21.2 v57.96,44.45 58.28,44.77 C53.1 R24.1
  Bottom 0.406: v57.96,44.45 58.6,45.09 IC1.3
N$17  (via drill 0.6 pad 1.27)
  Top 0.406: R35.2 v57.96,38.1 58.28,38.42 C66.1 R37.1
  Bottom 0.406: v57.96,38.1 58.6,38.73 IC6.3
N$18
  Top 0.406: R30.1 27.8,37.15 29.39,38.73 30.34,38.73 R34.2 C63.1 36.06,39.05 37.01,38.1 39.55,38.1 40.18,38.73 IC8.2
N$19
  Top 0.406: IC4.7 52.88,32.38 53.52,31.75 R23.1
N$20
  Top 0.406: IC4.6 52.88,31.11 54.15,29.84 R19.1
N$21  (via drill 0.6 pad 1.27)
  Top 0.406: R19.2 v57.96,29.84 58.6,30.48 R15.1 C44.2
  Bottom 0.406: v57.96,29.84 59.23,31.11 IC2.2
N$22  (via drill 0.6 pad 1.27)
  Top 0.406: R23.2 v57.96,31.75 58.28,32.07 C54.1 R25.1
  Bottom 0.406: v57.96,31.75 58.6,32.38 IC2.3
N$23
  Top 0.406: R18.1 27.8,30.8 29.39,32.38 30.02,32.38 30.66,33.02 R22.2 C49.1 36.06,32.7 37.01,31.75 39.55,31.75 40.18,32.38 IC4.2
N$24
  Bottom 0.305: C69.1 26.83,38.1
  Bottom 0.406: R38.1 26.83,38.1 R39.1
N$25
  Top 0.406: IC7.7 52.88,26.04 53.52,25.4 R33.1
N$26
  Bottom 0.406: SJ1.2 24.55,39.55 24.89,39.22 R38.2
N$27
  Bottom 0.406: SJ2.2 24.59,36.65 R39.2
N$28
  Bottom 0.406: SJ4.2 24.59,28.39 R41.2
N$29
  Bottom 0.305: C72.1 26.83,29.84
  Bottom 0.406: R40.1 26.83,29.84 R41.1
N$30
  Bottom 0.406: SJ3.2 24.55,31.3 24.92,30.94 24.92,30.95 R40.2
N$31
  Top 0.406: R44.2 OK1.1
N$32
  Top 0.406: R46.2 OK1.3
N$33
  Top 0.406: OK1.8 R45.1
N$34
  Top 0.406: OK1.6 R47.1
N$35
  Top 0.406: IC7.6 52.88,24.77 54.15,23.5 R29.1
N$36
  Top 0.406: OK2.6 R53.1
N$37  (via drill 0.6 pad 1.27)
  Top 0.406: R29.2 v57.96,23.5 58.6,24.13 R26.1 C55.2
  Bottom 0.406: v57.96,23.5 59.23,24.77 IC5.2
N$38
  Top 0.406: OK2.8 R51.1
N$39  (via drill 0.6 pad 1.27)
  Top 0.406: R33.2 v57.96,25.4 58.28,25.72 C62.1 R36.1
  Bottom 0.406: v57.96,25.4 58.6,26.04 IC5.3
N$40
  Top 0.406: R50.2 OK2.1
N$41
  Top 0.406: R28.1 27.8,24.45 29.39,26.04 30.34,26.04 R32.2 C58.1 36.06,26.35 37.01,25.4 39.55,25.4 40.18,26.04 IC7.2
N$43
  Top 0.406: R52.2 OK2.3
N$44
  Top 0.406: R57.1 9.07,13.97 9.07,10.16 +12V.A
N$45  (via drill 0.6 pad 1.27)
  Top 0.203: v64.95,8.26 R56.2
  Bottom 0.203: v64.95,8.26 65.58,8.26 66.85,6.99 74.79,6.99 83.44,15.63 83.46,15.76 83.46,26.04 | 83.46,26.04 83.59,26.49 83.57,26.49 | IWIFI.12 83.57,26.06 83.46,26.04
N$46
  Top 0.406: WIFI.A R56.1
N$49
  Top 0.203: IWIFI.5 IWIFI.7
N$53
  Bottom 0.203: U1.43 90.06,67.98 R2.2
N$56
  Bottom 0.203: U1.42 88.03,68.48 R3.2
N$59  (via drill 0.6)
  Top 0.305: v77.01,62.87 75.74,62.87 75.43,62.55 R1.1
  Bottom 0.305: U1.53 77.13,62.98 v77.01,62.87
RX2
  Bottom 0.203: U1.5 65.18,75.65 63.68,77.15 63.68,91.76 66.22,94.3 92.61,94.3 94.88,92.02 94.88,38.2 92.06,35.38 84.66,35.38 IWIFI.4
SCL  (via drill 0.6)
  Top 0.305: v73.2,48.9 73.84,48.9 75.11,47.62 75.11,46.04 R54.2
  Top 0.406: U7.PIN6 77.65,43.18 76.38,44.45 76.06,44.45 R54.2
  Bottom 0.305: U1.87 73.68,49.38 v73.2,48.9
SDA  (via drill 0.6)
  Top 0.305: v75.11,49.53 77.01,47.62 77.01,46.04 R55.2
  Top 0.406: U7.PIN5 78.92,43.18 77.65,44.45 77.65,45.72 R55.2
  Bottom 0.305: U1.86 74.18,50.45 v75.11,49.53
TX2
  Bottom 0.203: U1.6 65.68,75.78 64.31,77.15 64.31,91.44 66.53,93.66 92.57,93.66 94.47,91.76 94.47,38.73 92.25,36.51 86.19,36.51 86.12,36.52 86.11,36.55 86.11,36.52 IWIFI.3
VBG  (via drill 0.6)
  Top 0.305: R4.2 78.6,68.89 | 78.92,69.22 C27.1 78.6,68.89 | v80.82,68.58 78.92,68.58 78.6,68.89 | 78.6,68.89 78.28,69.22
  Bottom 0.305: U1.40 81.72,69.48 v80.82,68.58
VBUS
  Bottom 0.203: U1.39 81.96,69.98 81.14,70.8 81.14,73.34 82.09,74.3 82.09,80.89 X1.1
  Bottom 1.27: X1.1 83.73,88.58 C29.1 75.27,88.58 U2.3
VDDANA  (via drill 0.6)
  Top 0.305: v82.09,51.44 81.03,52.5 78.87,52.5 78.87,52.37 | 78.87,52.37 75.15,52.37 75.11,52.7 75.42,53.02 C10.1 C11.1 | L1.2 78.87,52.37
  Bottom 0.305: U1.73 v82.09,51.43 v82.09,51.44
VDDOUT  (via drill 0.6)
  Top 0.305: 70.66,75.56 70.66,71.12 70.03,70.48 v68.12,70.48 68.12,66.67 65.58,64.14 | v73.2,60.33 73.52,60.01 C16.1 C17.1 79.24,60.33 79.55,60.33 | v80.82,59.05 79.55,60.33 | 79.55,60.33 v80.82,61.59 79.87,62.55 79.55,62.55 | C18.1 79.55,62.55 | v80.82,64.77 80.82,63.82 79.55,62.55 | C15.1 67.17,55.56 v65.58,53.98 65.58,60.83 v64.82,61.59 65.58,62.36 65.58,64.14 | C14.1 65.58,64.14
  Top 0.406: C12.1 C13.1 70.34,75.56 70.66,75.56 L4.1
  Bottom 0.305: U1.10 67.68,70.92 v68.12,70.48 73.2,65.41 v73.2,60.33 | U1.124 64.21,60.98 v64.82,61.59 | U1.104 65.18,53.58 v65.58,53.98 | U1.61 80.9,58.98 v80.82,59.05 | U1.56 80.94,61.48 v80.82,61.59 | U1.45 79.86,66.98 79.55,66.67 79.55,65.41 80.19,64.77 v80.82,64.77
VDDOUTMI  (via drill 0.6 pad 1.27)
  Top 0.203: 84.81,70.17 84.95,70.48 L2.2 84.63,70.48
  Top 0.305: 84.81,70.17 v84.81,69.53 88.12,69.53 88.76,70.17 C8.1 C9.1
  Bottom 0.305: U1.41 84.26,68.98 v84.81,69.53
VDDPLL  (via drill 0.6)
  Top 0.305: v80.19,71.12 80.02,71.12 L4.2
  Top 0.406: L4.2 75.74,75.73 C21.1 C22.1
  Bottom 0.305: U1.34 79.68,71.62 v80.19,71.12
VIN(+12V)
  Top 0.406: D9.A 13.51,85.34
  Top 2.54: AMPSEAL1.1 13.51,85.34
XIN
  Bottom 0.305: U1.36 80.68,75.93 C24.1 80.95,78.83 Y1.1
XIN32
  Bottom 0.305: Y2.P$2 91.02,66.95 C26.1 | U1.48 85.88,65.48 87.33,66.93 88.44,66.93
  Bottom 0.406: Y2.P$2 88.44,66.93
XOUT
  Bottom 0.305: U1.35 80.18,74.3 79.55,74.93 79.55,80.01 78.28,81.28 | 78.28,81.28 78.28,80.81 | 78.28,81.28 78.28,83.19 78.15,83.31 C23.1 | 78.28,80.64 78.28,80.81 | 78.28,80.81 Y1.3
XOUT32
  Bottom 0.305: Y2.P$1 91.02,63.85 C25.1 | U1.49 86.05,64.98 87.17,63.86 Y2.P$1
  Bottom 0.406: Y2.P$1

## Text on the board
tNames: U7
tStop: GEVCU-4